# Altium project ESP32_ATMEL.PrjPcb
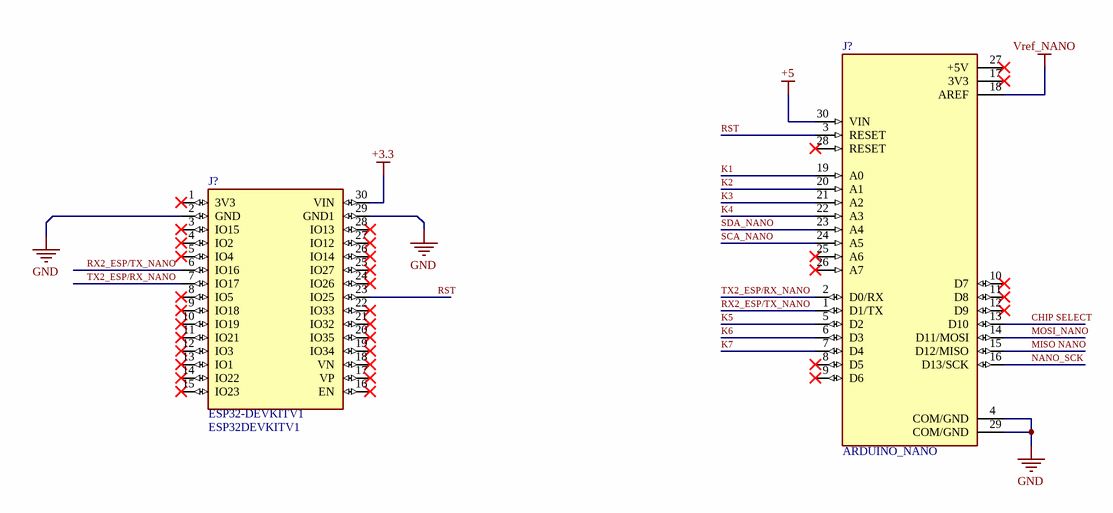
[diagram p0: microcontroller.SchDoc]
4 sheets, 19 parts. Net scope: flat (ports and power ports of the same name join across sheets).
Board file: ESP_ATMEL.PcbDoc
Sheets:
  microcontroller.SchDoc
  PowerSupply.SchDoc
  CheckingSystem.SchDoc
  ChargingSystem_LowVoltageCutOff.SchDoc

## Sheet microcontroller.SchDoc: <?>
size 420 x 297 mm; ApprovedBy: <?>; CheckedBy: <?>; CompanyName: ISON IMPORT-EXPORT COMPANY LIMITED; DrawnBy: <?>; DocumentNumber: <?>; Revision: <?>; SheetNumber: <?>; SheetTotal: <?>; Size: A3; ISON_Model: <?>

### Parts
(Parts that share a designator on the sheet are numbered #1, #2 ... from top to bottom, then left to right.)
J?#1  ESP32DEVKITV1  [ESP32-DEVKITV1_3D]
J?#2  ARDUINO_NANO  [SHIELD_ARDUINO_NANO]

### Nets
+3.3: J?#1.30(VIN)
+5: J?#2.30(VIN)
GND: J?#1.2(GND) J?#1.29(GND1) J?#2.4(COM/GND) J?#2.29(COM/GND)
Vref_NANO: J?#2.18(AREF)
CHIP SELECT: J?#2.13(D10)
K1: J?#2.19(A0)
K2: J?#2.20(A1)
K3: J?#2.21(A2)
K4: J?#2.22(A3)
K5: J?#2.5(D2)
K6: J?#2.6(D3)
K7: J?#2.7(D4)
MISO NANO: J?#2.15(D12/MISO)
MOSI_NANO: J?#2.14(D11/MOSI)
NANO_SCK: J?#2.16(D13/SCK)
RST: J?#1.23(IO25) J?#2.3(RESET)
RX2_ESP/TX_NANO: J?#1.6(IO16) J?#2.1(D1/TX)
SCA_NANO: J?#2.24(A5)
SDA_NANO: J?#2.23(A4)
TX2_ESP/RX_NANO: J?#1.7(IO17) J?#2.2(D0/RX)

Not connected (* = marked no-connect by the designer): J?#1 1(3V3)* 3(IO15)* 4(IO2)* 5(IO4)* 8(IO5)* 9(IO18)* 10(IO19)* 11(IO21)* 12(IO3)* 13(IO1)* 14(IO22)* 15(IO23)* 16(EN)* 17(VP)* 18(VN)* 19(IO34)* 20(IO35)* 21(IO32)* 22(IO33)* 24(IO26)* 25(IO27)* 26(IO14)* 27(IO12)* 28(IO13)*; J?#2 8(D5)* 9(D6)* 10(D7)* 11(D8)* 12(D9)* 17(3V3)* 25(A6)* 26(A7)* 27(+5V)* 28(RESET)*

### Notes on the sheet
- Modify 1:
- DWG No:
- Model:
- SHEET:
- Modify 2:
- ORIGINAL:
- Revision:
- Date:
- Draw By:
- Size:
- File:
- Approve By:
- TOTAL:
- Modify 3:
- (in symbol ESP32DEVKITV1) ESP32-DEVKITV1

### Library data of the parts
J?#1 = ESP32DEVKITV1: Dual core, Wi-Fi: 2.4 GHz up to 150 Mbits/s,BLE (Bluetooth Low Energy) and legacy Bluetooth, 32 bits, Up to 240 MHz; MF: Do it; Check_prices: https://www.snapeda.com/parts/ESP32%20DEVKIT%20V1/Do%20it/view-part/5659245/?ref=eda; Value: *; SnapEDA_Link: https://www.snapeda.com/parts/ESP32%20DEVKIT%20V1/Do%20it/view-part/5659245/?ref=snap; Package: Package; Availability: Unavailable; Price: None; MP: ESP32 DEVKIT V1
J?#2 = ARDUINO_NANO: Small, complete, and breadboard-friendly board based on the ATmega328 (Arduino Nano 3.x); Check_prices: https://www.snapeda.com/parts/Arduino%20Nano/Arduino/view-part/?ref=eda; Value: *; Availability: Not in stock; MP: Arduino Nano; Price: None; Package: Non-Standard Arduino; SnapEDA_Link: https://www.snapeda.com/parts/Arduino%20Nano/Arduino/view-part/?ref=snap; MF: Arduino

## Sheet PowerSupply.SchDoc: <?>
size 420 x 297 mm; ApprovedBy: <?>; CheckedBy: <?>; CompanyName: ISON IMPORT-EXPORT COMPANY LIMITED; DrawnBy: <?>; DocumentNumber: <?>; Revision: <?>; SheetNumber: <?>; SheetTotal: <?>; Size: A3; ISON_Model: <?>
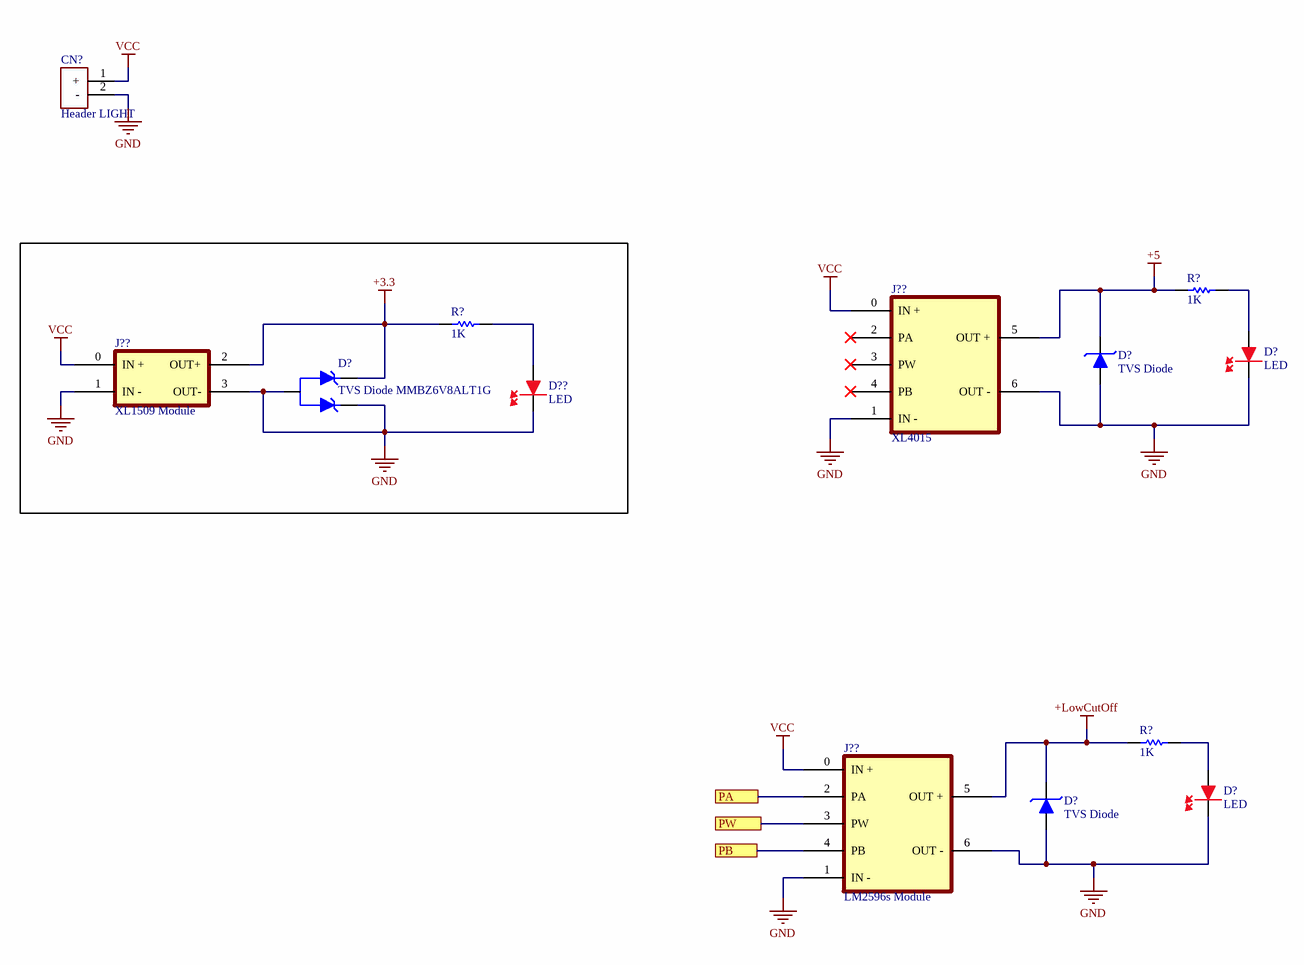
[diagram p1: PowerSupply.SchDoc]

### Parts
(Parts that share a designator on the sheet are numbered #1, #2 ... from top to bottom, then left to right.)
CN?#1  Header LIGHT  [HEADER 2 PIN MOLEX POLE]
D?#1  TVS Diode  [SOD-128]
D?#2  LED  [0805 LED]
D?#3  TVS Diode MMBZ6V8ALT1G  [SOT95P237X111-3N]
D?#4  LED  [0805 LED]
D?#5  TVS Diode  [SOD-128]
D??#1  LED  [0805 LED]
J??#1  XL4015  [XL4015 Module]
J??#2  XL1509 Module  [XL1509 MODULE]
J??#3  LM2596s Module  [LM2596s MODULE]
R?#1  1K  [0805 Modificado]
R?#2  1K  [0805 Modificado]
R?#3  1K  [0805 Modificado]

### Ports
PA, PB, PW

### Nets
+3.3: D?#3.2(K2) J??#2.2(OUT+) R?#2.2
+5: D?#1.2(K) J??#1.5(OUT_+) R?#1.2
+LowCutOff: D?#5.2(K) J??#3.5(OUT_+) R?#3.2
GND: CN?#1.2(-) D?#1.1(A) D?#2.1(K) D?#3.1(K1) D?#3.3(A) D?#4.1(K) D?#5.1(A) D??#1.1(K) J??#1.1(IN_-) J??#1.6(OUT_-) J??#2.1(IN_-) J??#2.3(OUT-) J??#3.1(IN_-) J??#3.6(OUT_-)
VCC: CN?#1.1(+) J??#1.0(IN_+) J??#2.0(IN_+) J??#3.0(IN_+)
NetD?#2_2: D?#2.2(A) R?#1.1
NetD?#4_2: D?#4.2(A) R?#3.1
NetD??#1_2: D??#1.2(A) R?#2.1
NetJ??#3_2: J??#3.2(PA) ; port PA
NetJ??#3_3: J??#3.3(PW) ; port PW
NetJ??#3_4: J??#3.4(PB) ; port PB

Not connected (* = marked no-connect by the designer): J??#1 2(PA)* 3(PW)* 4(PB)*

### Notes on the sheet
- Modify 1:
- DWG No:
- Model:
- SHEET:
- Modify 2:
- ORIGINAL:
- Revision:
- Date:
- Draw By:
- Size:
- File:
- Approve By:
- TOTAL:
- Modify 3:

### Library data of the parts
CN?#1 = CON Header LIGHT Pole: Connector 3.96MM 02 PIN WAFER STRAIGHTPIN (MALE)
D?#1 = TVS Diode VS24VUA1LAMTR: TVS Diode VS24VUA1LAMTR . Breakdown Voltage = 28.1 V , Clamping Voltage 38.9 V , Working Reverse Standoff Voltage 24V; Published: 8-Jun-2000; LatestRevisionDate: 17-Jul-2002; LatestRevisionNote: Re-released for DXP Platform.; DatasheetVersion: 1998; PackageVersion: Aug-1999; PackageReference: DO-41; Publisher: Altium Limited; PackageDescription: Diode, Axial; Body 5.2 x 2.7 mm (LxDia. max), Lead Dia. 0.86 mm (max); Code_JEDEC: DO-204-AL; ComponentLink1Description: Manufacturer Link; ComponentLink1URL: http://www.fairchildsemi.com/; ComponentLink2Description: Datasheet; ComponentLink2URL: http://www.fairchildsemi.com/ds/1N%2F1N4001.pdf
D?#2 D?#4 D??#1 = LED RED (SMD): LED SMD  mcd,Red Color Red Diffused Lens
D?#3 = TVS Diode MMBZ6V8ALT1G: 46V Clamp 870mA Ipp Tvs Diode Surface Mount SOT-23-3 (TO-236); Package: None; Price: None; Value: *; MP: MMBZ6V8ALT1G; Availability: Unavailable
D?#5 = TVS Diode VS6V0UA1LAMTR: TVS Diode VS6V0UA1LAMTR . Breakdown Voltage = 6.795V , Clamping Voltage 10.5 V , Working Reverse Standoff Voltage 5V; Published: 8-Jun-2000; LatestRevisionDate: 17-Jul-2002; LatestRevisionNote: Re-released for DXP Platform.; DatasheetVersion: 1998; PackageVersion: Aug-1999; PackageReference: DO-41; Publisher: Altium Limited; PackageDescription: Diode, Axial; Body 5.2 x 2.7 mm (LxDia. max), Lead Dia. 0.86 mm (max); Code_JEDEC: DO-204-AL; ComponentLink1Description: Manufacturer Link; ComponentLink1URL: http://www.fairchildsemi.com/; ComponentLink2Description: Datasheet; ComponentLink2URL: http://www.fairchildsemi.com/ds/1N%2F1N4001.pdf
J??#1 = Buck XL4015 Module 5A: XL4015 Module step down converter
J??#2 = Buck XL1509 Module: XL1509 Module step down converter
J??#3 = Buck LM2596s Module 5A: LM2596s Module step down converter
R?#1-R?#3 = Resistor 0805 SMD 1K OHM +/- 1% (CHIP): 'RES SMD 1K OHM 1% 1/8W 0805/0805W8F1001T5E

## Sheet CheckingSystem.SchDoc: <?>
size 420 x 297 mm; ApprovedBy: <?>; CheckedBy: <?>; CompanyName: ISON IMPORT-EXPORT COMPANY LIMITED; DrawnBy: <?>; DocumentNumber: <?>; Revision: <?>; SheetNumber: <?>; SheetTotal: <?>; Size: A3; ISON_Model: <?>
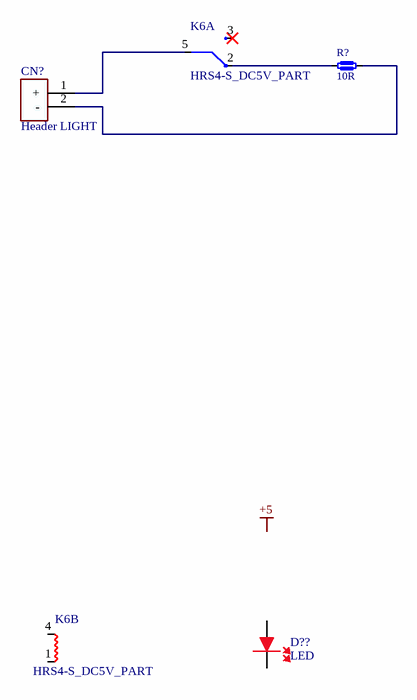
[diagram p2: CheckingSystem.SchDoc]

### Parts
(Parts that share a designator on the sheet are numbered #1, #2 ... from top to bottom, then left to right.)
CN?#2  Header LIGHT  [HEADER 2 PIN MOLEX POLE]
D??#2  LED  [0805 LED]
K6  HRS4-S_DC5V_PART  [HRS4SDC5V]  (parts A,B of 2)
R?#4  10R

### Nets
NetCN?#2_1: CN?#2.1(+) K6.5(COM)
NetCN?#2_2: CN?#2.2(-) R?#4.1
NetK6_2: K6.2(NC) R?#4.2

Not connected (* = marked no-connect by the designer): D??#2 1(K) 2(A); K6 1(COIL_1) 3(NO)* 4(COIL_2)

### Notes on the sheet
- Labels drawn without touching a wire or pin: +5
- Modify 1:
- DWG No:
- Model:
- SHEET:
- Modify 2:
- ORIGINAL:
- Revision:
- Date:
- Draw By:
- Size:
- File:
- Approve By:
- TOTAL:
- Modify 3:

### Library data of the parts
CN?#2 = CON Header LIGHT Pole: as CN?#1 on sheet PowerSupply
D??#2 = LED RED (SMD): LED SMD  mcd,Red Color Red Diffused Lens
K6 = HRS4-S_DC5V_PART: Relay or Contactor; Manufacturer_Name: MULTICOMP; Manufacturer_Part_Number: HRS4-S DC5V; Datasheet Link: http://www.farnell.com/datasheets/1306711.pdf; Height: 16mm
R?#4 = Dummy Load: 10 OHM , 40 W . Made by Parallel of 2 Resistor 20 OHM 20 W

## Sheet ChargingSystem_LowVoltageCutOff.SchDoc: <?>
size 420 x 297 mm; ApprovedBy: <?>; CheckedBy: <?>; CompanyName: ISON IMPORT-EXPORT COMPANY LIMITED; DrawnBy: <?>; DocumentNumber: <?>; Revision: <?>; SheetNumber: <?>; SheetTotal: <?>; Size: A3; ISON_Model: <?>

### Notes on the sheet
- Modify 1:
- DWG No:
- Model:
- SHEET:
- Modify 2:
- ORIGINAL:
- Revision:
- Date:
- Draw By:
- Size:
- File:
- Approve By:
- TOTAL:
- Modify 3:

## Nets that join several sheets
+3.3: microcontroller (J?#1.30), PowerSupply (D?#3.2 J??#2.2 R?#2.2)
+5: microcontroller (J?#2.30), PowerSupply (D?#1.2 J??#1.5 R?#1.2)
GND: microcontroller (J?#1.2 J?#1.29 J?#2.4 J?#2.29), PowerSupply (14 pins)